# Altium project PCB_Project.PrjPcb
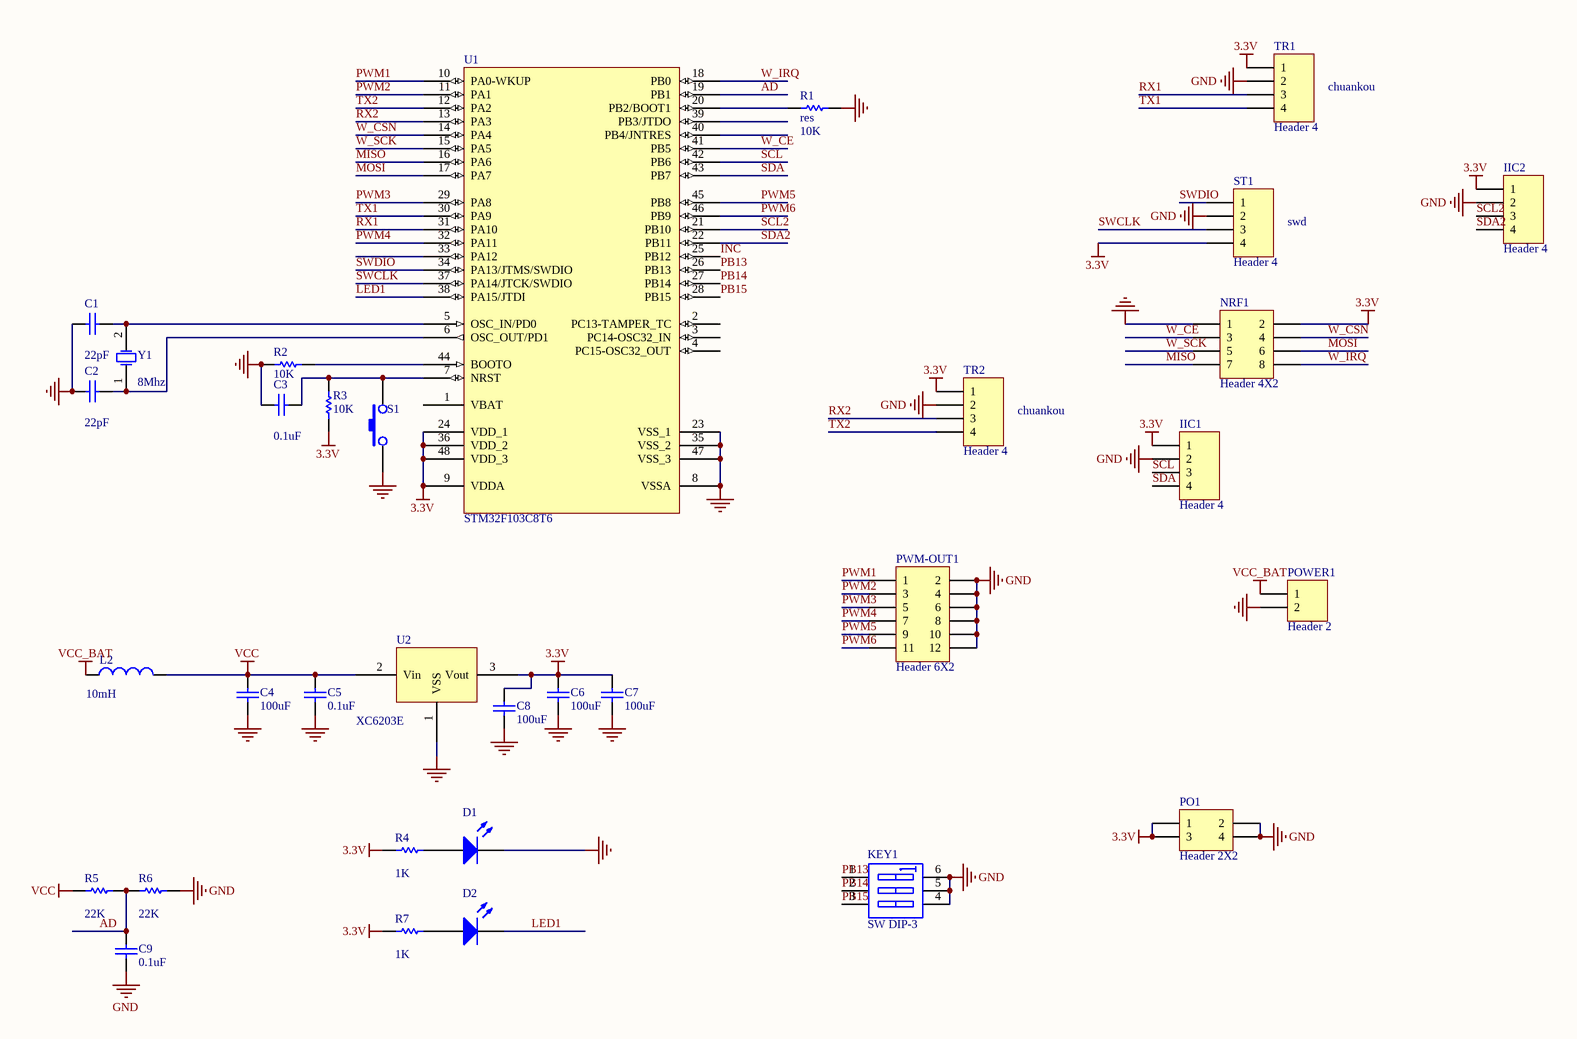
[diagram p0: Sheet2.SchDoc]
1 sheet, 33 parts. Net scope: global (net labels, ports and power ports of the same name join across sheets).
Board file: PCB1.PcbDoc

## Sheet Sheet2.SchDoc
size A3

### Parts
C1  value 22pF  [0603c]  (hidden comment: cap)
C2  value 22pF  [0603c]  (hidden comment: cap)
C3  value 0.1uF  [0603c]  (hidden comment: cap)
C4  value 100uF  [0603c]  (hidden comment: cap)
C5  value 0.1uF  [0603c]  (hidden comment: cap)
C6  value 100uF  [0603c]  (hidden comment: cap)
C7  value 100uF  [0603c]  (hidden comment: cap)
C8  value 100uF  [0603c]  (hidden comment: cap)
C9  value 0.1uF  [0603c]  (hidden comment: cap)
D1  LED0  [0603c]  (value not drawn)
D2  LED0  [0603c]  (value not drawn)
IIC1  Header 4  [HDR1X4]
IIC2  Header 4  [HDR1X4]
KEY1  SW DIP-3  [DIP6]
L2  value 10mH  [0805]  (hidden comment: Inductor)
NRF1  Header 4X2  [HDR2X4]
PO1  Header 2X2  [HDR2X2]
POWER1  Header 2  [HDR1X2]
PWM-OUT1  Header 6X2  [HDR2X6]
R1  res  res: 10K  [0603c]
R2  res: 10K  [0603c]  (hidden comment: res)
R3  res: 10K  [0603c]  (hidden comment: res)
R4  res: 1K  [0603c]  (hidden comment: res)
R5  res: 22K  [0603c]  (hidden comment: res)
R6  res: 22K  [0603c]  (hidden comment: res)
R7  res: 1K  [0603c]  (hidden comment: res)
S1  (no value)  [7243]
ST1  Header 4  [HDR1X4]
TR1  Header 4  [HDR1X4]
TR2  Header 4  [HDR1X4]
U1  STM32F103C8T6  [LQFP48S]
U2  XC6203E  [SOT-89]
Y1  5032xtal  [XTAL]  (value not drawn)

### Nets
3.3V: C6.2 C7.2 C8.2 IIC1.1 IIC2.1 NRF1.2 PO1.1 PO1.3 R3.1 R4.1 R7.1 ST1.4 TR1.1 TR2.1 U1.9(VDDA) U1.24(VDD_1) U1.36(VDD_2) U1.48(VDD_3) U2.3(Vout)
GND: C1.1 C2.1 C3.1 C4.1 C5.1 C6.1 C7.1 C8.1 C9.1 D1.2(K) IIC1.2 IIC2.2 KEY1.4(B3) KEY1.5(B2) KEY1.6(B1) NRF1.1 PO1.2 PO1.4 POWER1.2 PWM-OUT1.2 PWM-OUT1.4 PWM-OUT1.6 PWM-OUT1.8 PWM-OUT1.10 PWM-OUT1.12 R1.2 R2.1 R6.2 S1.1 ST1.2 TR1.2 TR2.2 U1.8(VSSA) U1.23(VSS_1) U1.35(VSS_2) U1.47(VSS_3) U2.1(VSS)
VCC: C4.2 C5.2 L2.2 R5.1 U2.2(Vin)
VCC_BAT: L2.1 POWER1.1
AD: C9.2 R5.2 R6.1 U1.19(PB1)
INC: U1.25(PB12)
LED1: D2.2(K) U1.38(PA15/JTDI)
MISO: NRF1.7 U1.16(PA6)
MOSI: NRF1.6 U1.17(PA7)
PB13: KEY1.1(A1) U1.26(PB13)
PB14: KEY1.2(A2) U1.27(PB14)
PB15: KEY1.3(A3) U1.28(PB15)
PWM1: PWM-OUT1.1 U1.10(PA0-WKUP)
PWM2: PWM-OUT1.3 U1.11(PA1)
PWM3: PWM-OUT1.5 U1.29(PA8)
PWM4: PWM-OUT1.7 U1.32(PA11)
PWM5: PWM-OUT1.9 U1.45(PB8)
PWM6: PWM-OUT1.11 U1.46(PB9)
RX1: TR1.3 U1.31(PA10)
RX2: TR2.3 U1.13(PA3)
SCL: IIC1.3 U1.42(PB6)
SCL2: IIC2.3 U1.21(PB10)
SDA: IIC1.4 U1.43(PB7)
SDA2: IIC2.4 U1.22(PB11)
SWCLK: ST1.3 U1.37(PA14/JTCK/SWDIO)
SWDIO: ST1.1 U1.34(PA13/JTMS/SWDIO)
TX1: TR1.4 U1.30(PA9)
TX2: TR2.4 U1.12(PA2)
W_CE: NRF1.3 U1.41(PB5)
W_CSN: NRF1.4 U1.14(PA4)
W_IRQ: NRF1.8 U1.18(PB0)
W_SCK: NRF1.5 U1.15(PA5)
NetC1_2: C1.2 U1.5(OSC_IN/PD0) Y1.2(OSC2)
NetC2_2: C2.2 U1.6(OSC_OUT/PD1) Y1.1(OSC1)
NetC3_2: C3.2 R3.2 S1.2 U1.7(NRST)
NetD1_1: D1.1(A) R4.2
NetD2_1: D2.1(A) R7.2
NetR1_1: R1.1 U1.20(PB2/BOOT1)
NetR2_2: R2.2 U1.44(BOOTO)

Not connected (* = marked no-connect by the designer): U1 1(VBAT) 2(PC13-TAMPER_TC) 3(PC14-OSC32_IN) 4(PC15-OSC32_OUT) 33(PA12) 39(PB3/JTDO) 40(PB4/JNTRES)

### Notes on the sheet
- chuankou
- swd
- (in symbol 5032xtal) 8Mhz

### Library data of the parts
D1 D2 = LED0: Typical INFRARED GaAs LED; Published: 8-Jun-2000; LatestRevisionDate: 08-Jul-2005; LatestRevisionNote: Mech Layer 1 removed.; PackageReference: LED-0; Publisher: Altium Limited
IIC1 IIC2 ST1 TR1 TR2 = Header 4: Header, 4-Pin; LatestRevisionDate: 17-Jul-2002; LatestRevisionNote: Re-released for DXP Platform.; Publisher: Altium Limited
KEY1 = SW DIP-3: DIP Switch
NRF1 = Header 4X2: Header, 4-Pin, Dual row; LatestRevisionDate: 17-Jul-2002; LatestRevisionNote: Re-released for DXP Platform.; Publisher: Altium Limited
PO1 = Header 2X2: Header, 2-Pin, Dual row; LatestRevisionDate: 17-Jul-2002; LatestRevisionNote: Re-released for DXP Platform.; Publisher: Altium Limited
POWER1 = Header 2: Header, 2-Pin; LatestRevisionDate: 17-Jul-2002; LatestRevisionNote: Re-released for DXP Platform.; Publisher: Altium Limited
PWM-OUT1 = Header 6X2: Header, 6-Pin, Dual row; LatestRevisionDate: 17-Jul-2002; LatestRevisionNote: Re-released for DXP Platform.; Publisher: Altium Limited
S1 = 微动开关
U2 = XC6203